# EAGLE design spoke-basic (EAGLE 5.10)
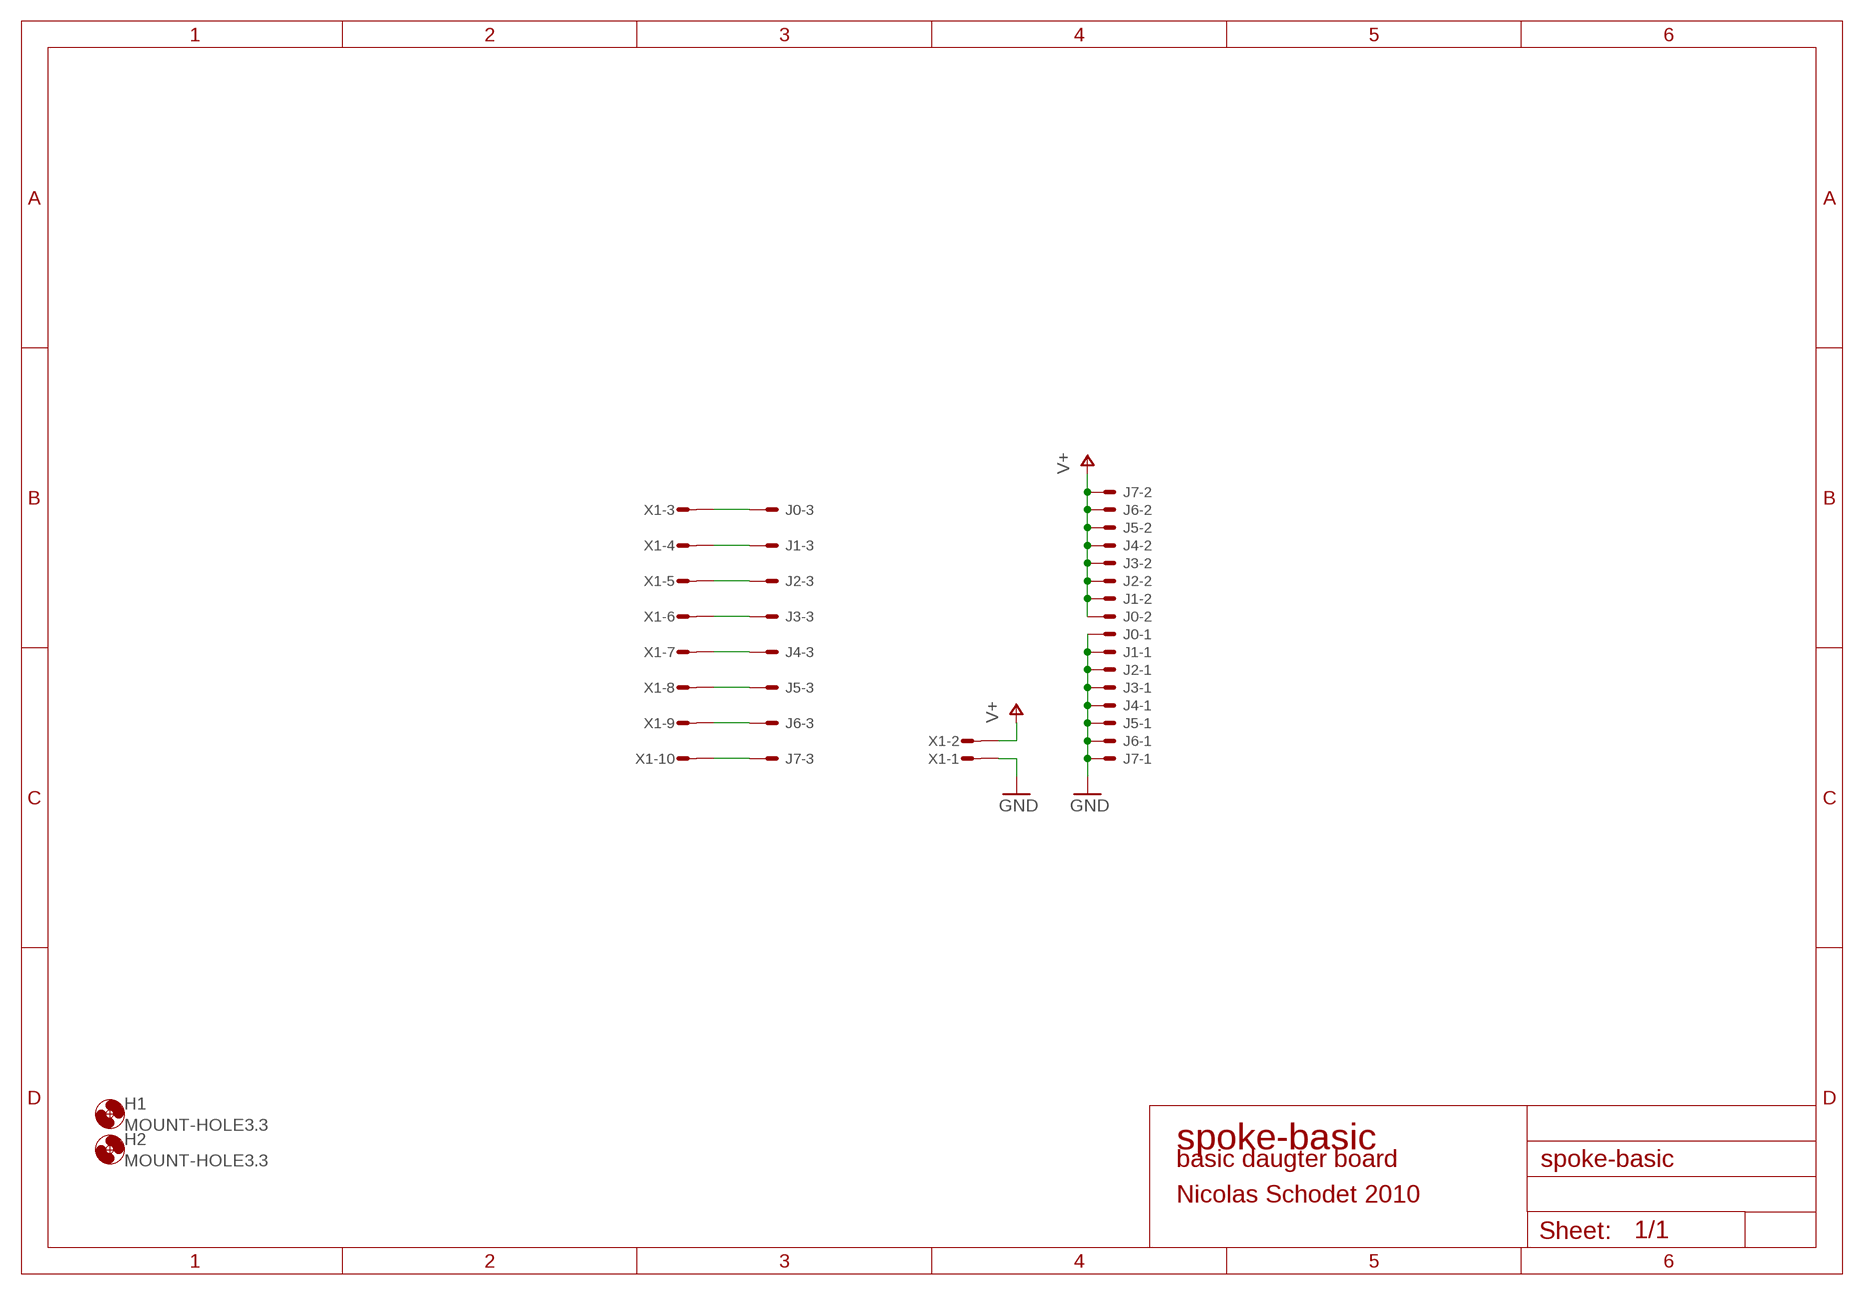
[diagram p0: schematic, sheet 1]

## Parts
H1  MOUNT-HOLE3.3  [3,3]
H2  MOUNT-HOLE3.3  [3,3]
J0  ED1X03  [ED1X03]
J1  ED1X03  [ED1X03]
J2  ED1X03  [ED1X03]
J3  ED1X03  [ED1X03]
J4  ED1X03  [ED1X03]
J5  ED1X03  [ED1X03]
J6  ED1X03  [ED1X03]
J7  ED1X03  [ED1X03]
X1  MICROMATCH-10  [MICROMATCH-10]

## Nets
GND [supply]: J0.1 J1.1 J2.1 J3.1 J4.1 J5.1 J6.1 J7.1 X1.1
N$1: J0.3 X1.3
N$2: J1.3 X1.4
N$3: J2.3 X1.5
N$4: J3.3 X1.6
N$5: J4.3 X1.7
N$6: J5.3 X1.8
N$7: J6.3 X1.9
N$8: J7.3 X1.10
V+: J0.2 J1.2 J2.2 J3.2 J4.2 J5.2 J6.2 J7.2 X1.2

## Notes on the sheet
- spoke-basic
- basic daugter board
- Nicolas Schodet 2010

## Library data of the parts
H1 H2 = holes:MOUNT-HOLE: MOUNTING HOLE with drill center marker
J0 J1-J7 = apbteam_con-amp-he14:E?1X03: Male header simple row, 3 positions
X1 = apbteam_con-amp-micromatch:MICROMATCH-10: MicroMaTch 10

## Net classes
1 supply: width 0.254 mm

## Board
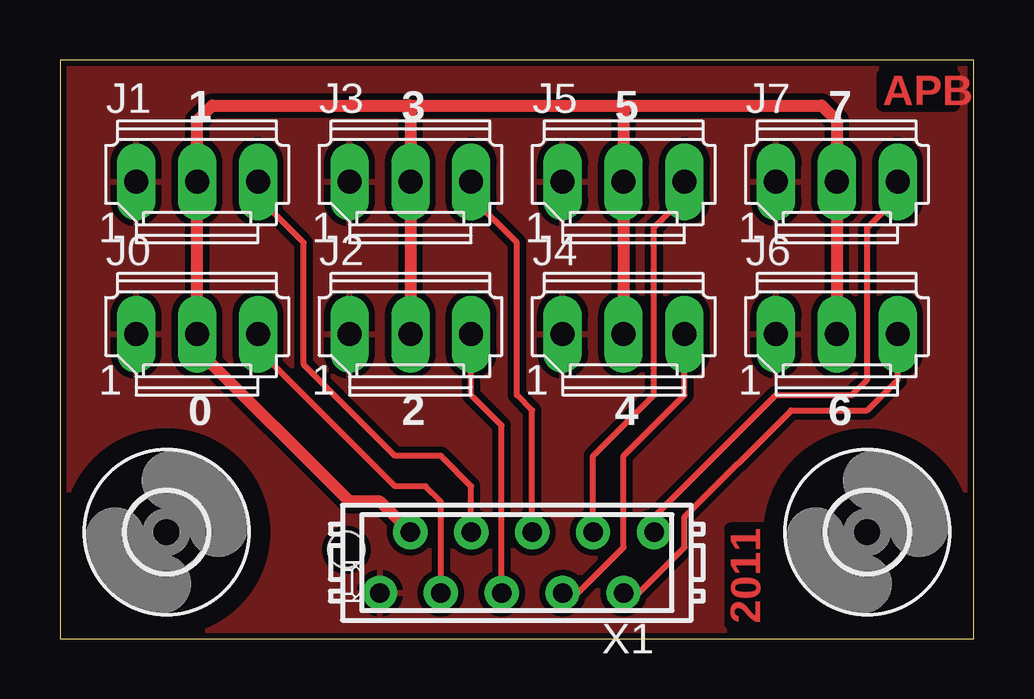
[diagram p1: board, top side]
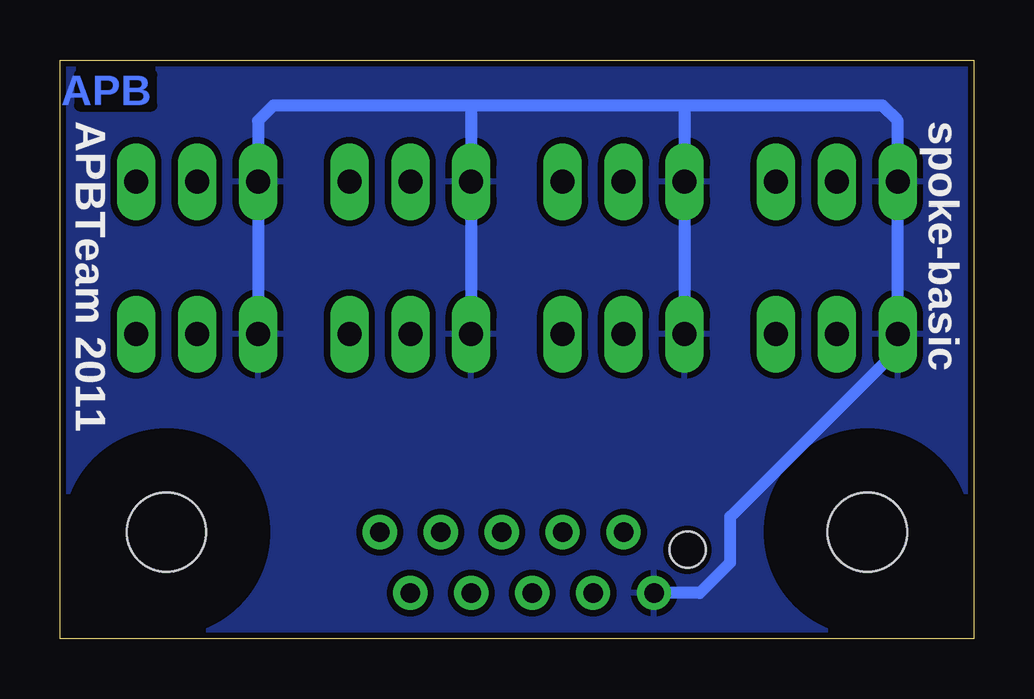
[diagram p2: board, bottom side, seen from below]

Size 38.1 x 24.13 mm. Coordinates in mm from the lower left corner, seen from the top.
Outline: 0,0 38.1,0 38.1,24.13 0,24.13 0,0
Copper layers (1*16): Top 0.035mm / dielectric 1.5mm / Bottom 0.035mm
Design rules "SparkFun": minimum track width 8mil, minimum drill 20mil, track to track 8mil, track to pad 8mil, pad to pad 8mil, via to via 8mil, smd to smd 8mil, copper to edge 10mil, drill to drill 8mil, minimum pad ring 12mil, minimum via ring 10mil, stop-mask expansion 4mil, vias tented up to drill 25mil, thermal gap 10mil

### Footprints (pad centres in the part's own frame; a part is rotated, then mirrored left to right if it is on the bottom)
3,3 = hole 3.3: 0,0
ED1X03 = drill 1 long: 1 -2.54,0; 2 0,0; 3 2.54,0
MICROMATCH-10 = drill 0.813 round: 1 5.715,1.27; 2 4.445,-1.27; 3 3.175,1.27; 4 1.905,-1.27; 5 0.635,1.27; 6 -0.635,-1.27; 7 -1.905,1.27; 8 -3.175,-1.27; 9 -4.445,1.27; 10 -5.715,-1.27 | hole 1.5: 7.11,-0.53

### Placement (x,y rotation side)
H1  4.45,4.45 0 top
H2  33.66,4.45 0 top
J0  5.71,12.7 0 top
J1  5.71,19.05 0 top
J2  14.61,12.7 0 top
J3  14.61,19.05 0 top
J4  23.5,12.7 0 top
J5  23.5,19.05 0 top
J6  32.38,12.7 0 top
J7  32.38,19.05 0 top
X1  19.05,3.17 180 top

### Tracks (layer width: path | path; a pad name or v marks a point on that pad's centre or on a via)
GND
  Bottom 0.508: X1.1 11.43,1.91 10.16,3.17 10.16,5.08 3.17,12.06 J0.1 J1.1 3.17,21.59 3.81,22.23 12.06,22.23 | 12.06,22.23 J3.1 J2.1 | 12.06,22.23 20.95,22.23 | 20.95,22.23 J5.1 J4.1 | 20.95,22.23 29.21,22.23 29.84,21.59 J7.1 J6.1
  pour Top (isolate 0.254): 0,24.13 38.1,24.13 38.1,0 0,0
  pour Bottom (isolate 0.254): 0,24.13 38.1,24.13 38.1,0 0,0
N$1
  Top 0.254: J0.3 8.26,12.06 13.97,6.35 15.24,6.35 15.88,5.71 X1.3
N$2
  Top 0.254: J1.3 8.26,18.41 10.16,16.51 10.16,11.43 13.97,7.62 15.88,7.62 17.14,6.35 X1.4
N$3
  Top 0.254: X1.5 18.41,8.89 17.14,10.16 J2.3
N$4
  Top 0.254: X1.6 19.68,9.53 19.05,10.16 19.05,16.51 17.14,18.41 J3.3
N$5
  Top 0.254: X1.7 21.59,1.91 23.5,3.81 23.5,7.62 26.04,10.16 J4.3
N$6
  Top 0.254: X1.8 22.23,7.62 24.77,10.16 24.77,17.14 26.04,18.41 J5.3
N$7
  Top 0.254: X1.9 24.13,1.91 26.04,3.81 26.04,5.08 30.48,9.53 33.66,9.53 34.92,10.79 J6.3
N$8
  Top 0.254: X1.10 24.77,5.08 29.84,10.16 33.02,10.16 33.66,10.79 33.66,17.14 34.92,18.41 J7.3
V+
  Top 0.508: X1.2 13.34,5.71 12.06,5.71 5.71,12.06 J0.2 J1.2 5.71,21.59 6.35,22.23 14.61,22.23 | 14.61,22.23 J3.2 J2.2 | 14.61,22.23 23.5,22.23 | 23.5,22.23 J5.2 J4.2 | 23.5,22.23 31.75,22.23 32.38,21.59 J7.2 J6.2

### Text on the board
Top: APB | 2011
Bottom: APB
tSilk: 1 | 3 | 5 | 7 | 0 | 2 | 4 | 6
bSilk: spoke-basic | APBTeam 2011